# Altium project Dashcam_V2.0B.PrjPcb (part 5 of 7)

## Sheet CAMERA.SchDoc
size A2; DrawnBy: UKAYACIK; Engineer: UKAYACIK; Organization: UKAYACIK; DocumentNumber: 21; Revision: B; SheetNumber: 21; SheetTotal: 21
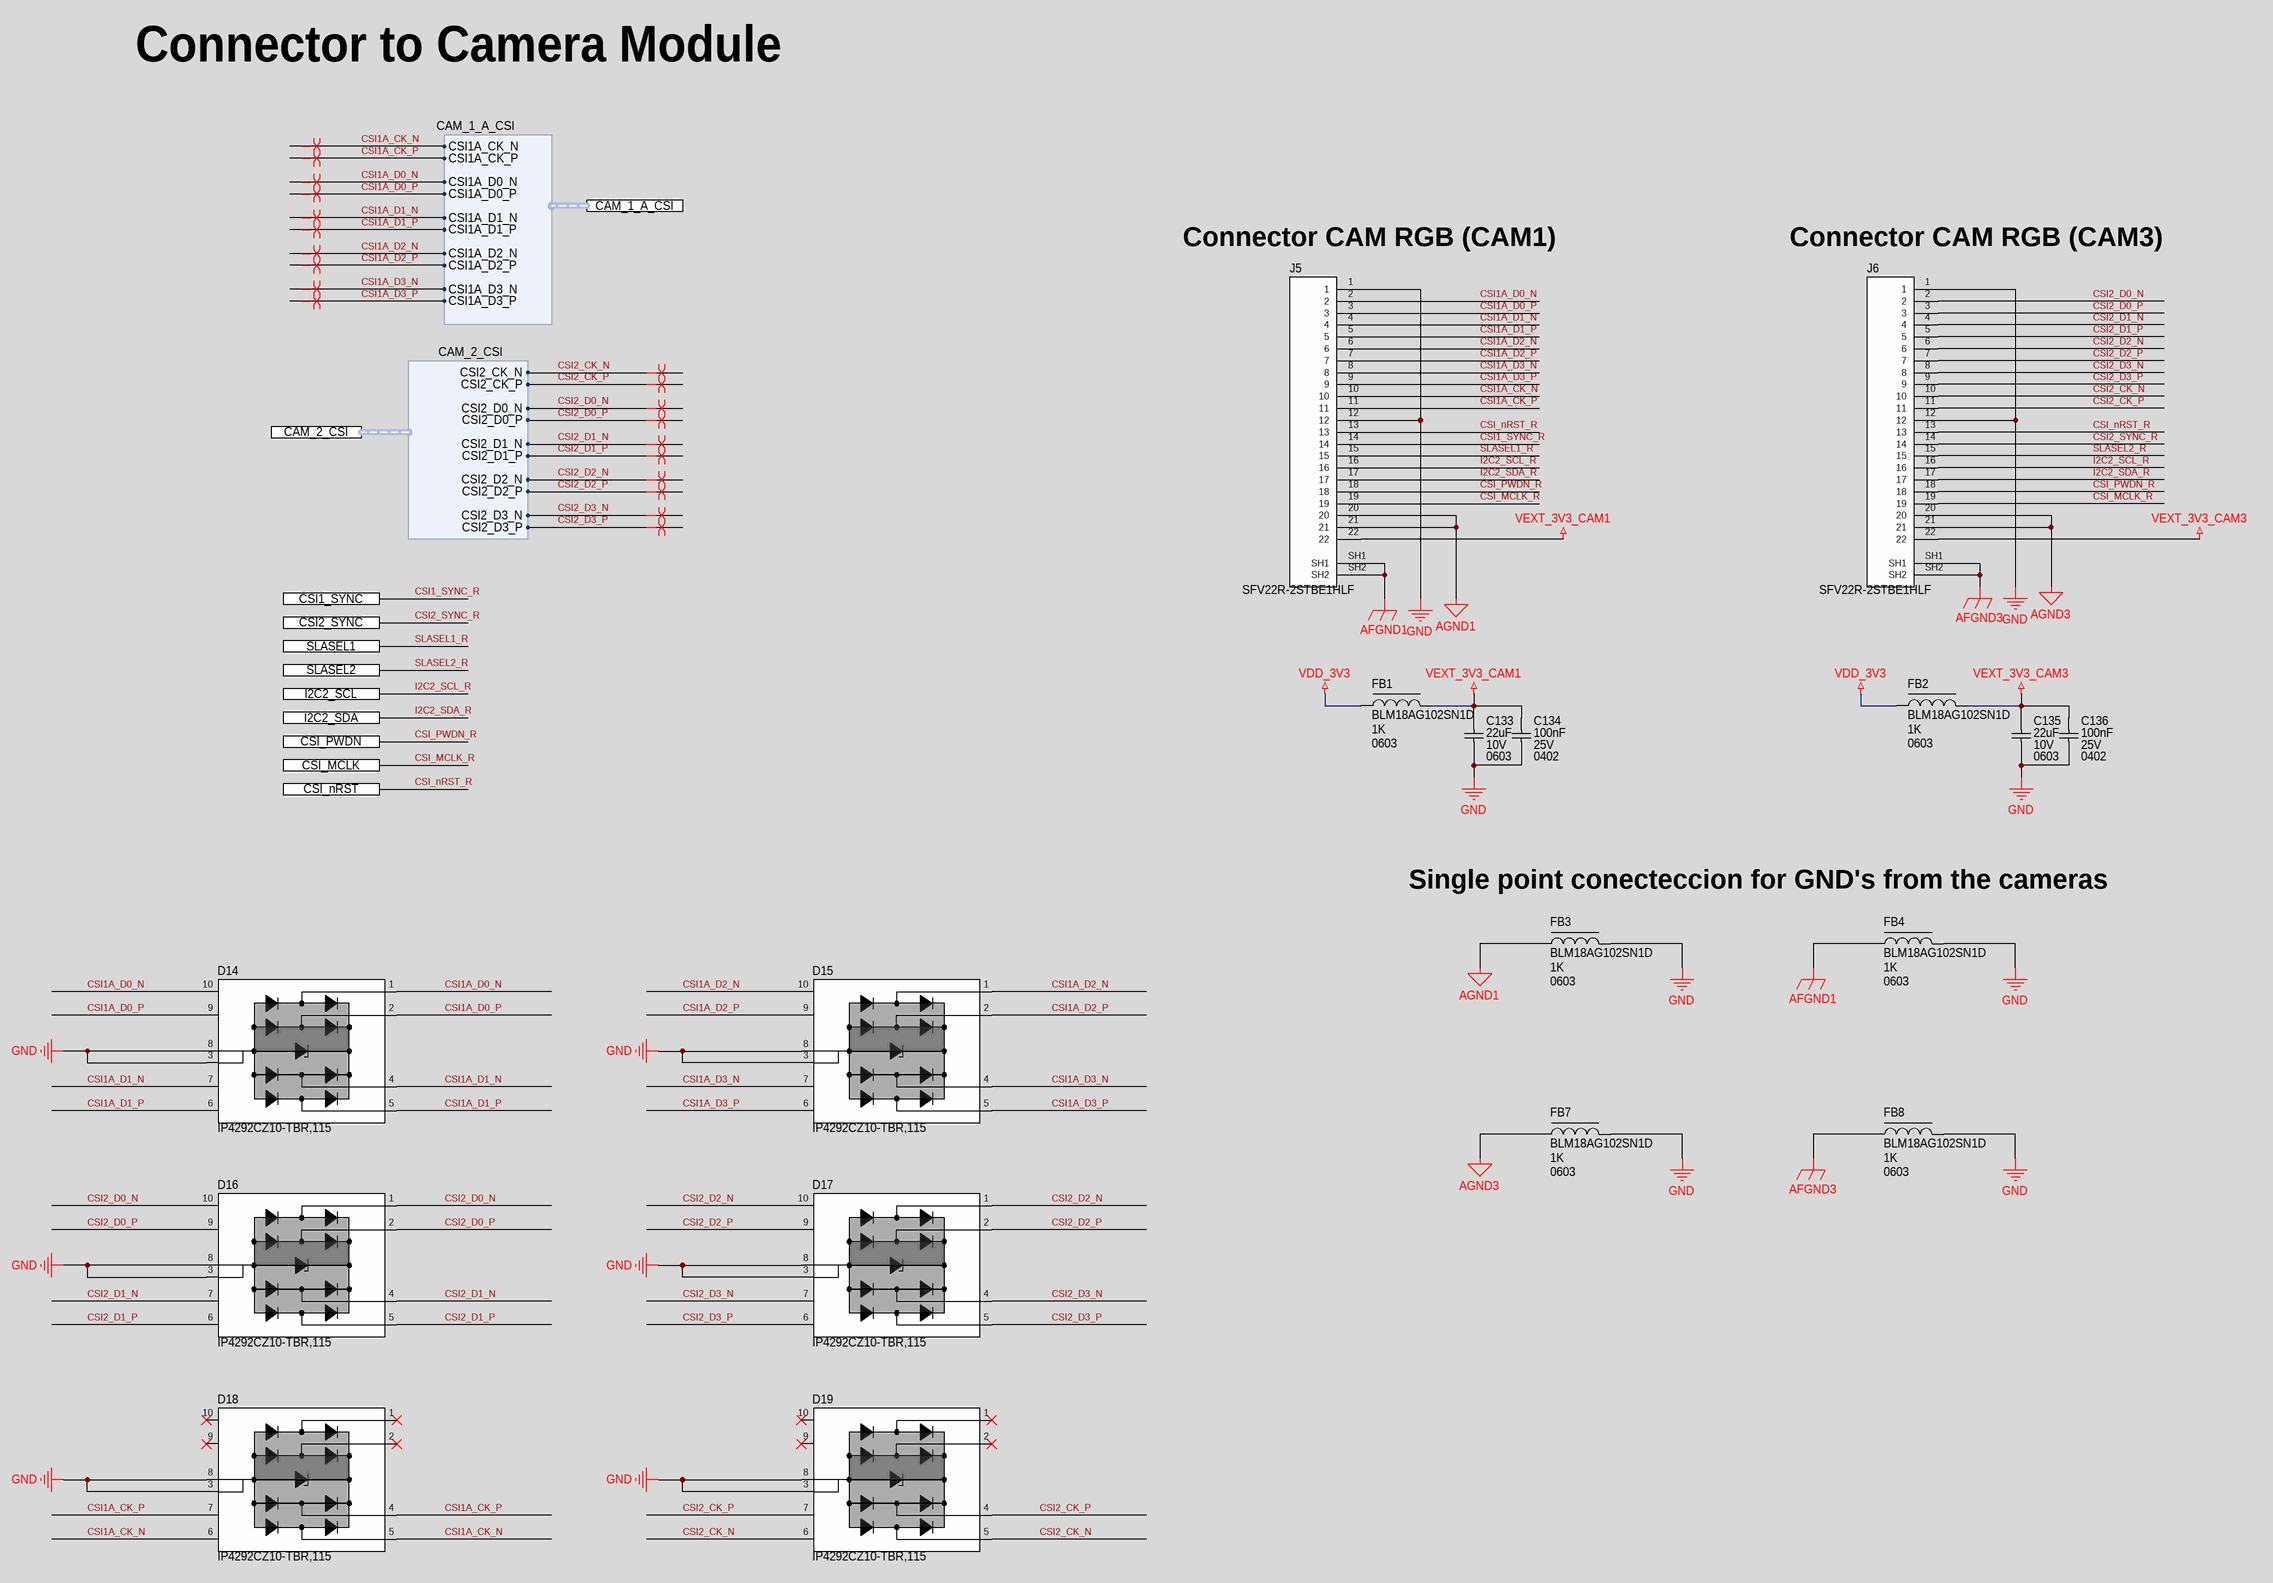
[diagram p11: CAMERA.SchDoc]

### Parts
C133  Capacitance: 22uF  Voltage Rating: 10V  Case Code (Imperial): 0603  [CAP_0603_CAPC1608X08N]  (hidden comment: C1608X5R1A226M080AC)
C134  Capacitance: 100nF  Voltage Rating: 25V  Case/Package: 0402  [CAP_0402_CAPC1005X05N]  (hidden comment: CC0402KRX5R8BB104)
C135  Capacitance: 22uF  Voltage Rating: 10V  Case Code (Imperial): 0603  [CAP_0603_CAPC1608X08N]  (hidden comment: C1608X5R1A226M080AC)
C136  Capacitance: 100nF  Voltage Rating: 25V  Case/Package: 0402  [CAP_0402_CAPC1005X05N]  (hidden comment: CC0402KRX5R8BB104)
D14  IP4292CZ10-TBR,115  [DIO_TVS_SON50P100X250X50-10N]
D15  IP4292CZ10-TBR,115  [DIO_TVS_SON50P100X250X50-10N]
D16  IP4292CZ10-TBR,115  [DIO_TVS_SON50P100X250X50-10N]
D17  IP4292CZ10-TBR,115  [DIO_TVS_SON50P100X250X50-10N]
D18  IP4292CZ10-TBR,115  [DIO_TVS_SON50P100X250X50-10N]
D19  IP4292CZ10-TBR,115  [DIO_TVS_SON50P100X250X50-10N]
FB1  BLM18AG102SN1D  Impedance: 1K  Case/Package: 0603  [IND_0603_INDC1608X08N]
FB2  BLM18AG102SN1D  Impedance: 1K  Case/Package: 0603  [IND_0603_INDC1608X08N]
FB3  BLM18AG102SN1D  Impedance: 1K  Case/Package: 0603  [IND_0603_INDC1608X08N]
FB4  BLM18AG102SN1D  Impedance: 1K  Case/Package: 0603  [IND_0603_INDC1608X08N]
FB7  BLM18AG102SN1D  Impedance: 1K  Case/Package: 0603  [IND_0603_INDC1608X08N]
FB8  BLM18AG102SN1D  Impedance: 1K  Case/Package: 0603  [IND_0603_INDC1608X08N]
J5  SFV22R-2STBE1HLF  [CONN_FPC_AMPHENOL_SFV22R-2STBE1HLF]
J6  SFV22R-2STBE1HLF  [CONN_FPC_AMPHENOL_SFV22R-2STBE1HLF]

### Ports
CAM_1_A_CSI (harness CAM_1_A_CSI), CAM_2_CSI (harness CAM_2_CSI), CSI1_SYNC, CSI2_SYNC, CSI_MCLK, CSI_nRST, CSI_PWDN, I2C2_SCL, I2C2_SDA, SLASEL1, SLASEL2

### Harnesses
CAM_2_CSI: CSI2_CK_N, CSI2_CK_P, CSI2_D0_N, CSI2_D0_P, CSI2_D1_N, CSI2_D1_P, CSI2_D2_N, CSI2_D2_P, CSI2_D3_N, CSI2_D3_P
CAM_1_A_CSI: CSI1A_CK_N, CSI1A_CK_P, CSI1A_D0_N, CSI1A_D0_P, CSI1A_D1_N, CSI1A_D1_P, CSI1A_D2_N, CSI1A_D2_P, CSI1A_D3_N, CSI1A_D3_P

### Nets
AFGND1: FB4.1 J5.SH1 J5.SH2
AFGND3: FB8.1 J6.SH1 J6.SH2
AGND1: FB3.1 J5.20 J5.21
AGND3: FB7.1 J6.20 J6.21
GND: C133.1 C134.1 C135.1 C136.1 D14.3(GND1) D14.8(GND2) D15.3(GND1) D15.8(GND2) D16.3(GND1) D16.8(GND2) D17.3(GND1) D17.8(GND2) D18.3(GND1) D18.8(GND2) D19.3(GND1) D19.8(GND2) FB3.2 FB4.2 FB7.2 FB8.2 J5.1 J5.12 J6.1 J6.12
VDD_3V3: FB1.1 FB2.1
VEXT_3V3_CAM1: C133.2 C134.2 FB1.2 J5.22
VEXT_3V3_CAM3: C135.2 C136.2 FB2.2 J6.22
CSI1_SYNC_R: J5.14 J6.14 ; port CSI1_SYNC, port CSI2_SYNC  [also labelled CSI2_SYNC_R]  [project net CLKOUT2]
CSI1A_CK_N: D18.5(CH4) D18.6(NC1) J5.10 ; port CAM_1_A_CSI.CSI1A_CK_N  [project net CSI1_CK_N]
CSI1A_CK_P: D18.4(CH3) D18.7(NC2) J5.11 ; port CAM_1_A_CSI.CSI1A_CK_P  [project net CSI1_CK_P]
CSI1A_D0_N: D14.1(CH1) D14.10(NC4) J5.2 ; port CAM_1_A_CSI.CSI1A_D0_N  [project net CSI1_D0_N]
CSI1A_D0_P: D14.2(CH2) D14.9(NC3) J5.3 ; port CAM_1_A_CSI.CSI1A_D0_P  [project net CSI1_D0_P]
CSI1A_D1_N: D14.4(CH3) D14.7(NC2) J5.4 ; port CAM_1_A_CSI.CSI1A_D1_N  [project net CSI1_D1_N]
CSI1A_D1_P: D14.5(CH4) D14.6(NC1) J5.5 ; port CAM_1_A_CSI.CSI1A_D1_P  [project net CSI1_D1_P]
CSI1A_D2_N: D15.1(CH1) D15.10(NC4) J5.6 ; port CAM_1_A_CSI.CSI1A_D2_N  [project net CSI1_D2_N]
CSI1A_D2_P: D15.2(CH2) D15.9(NC3) J5.7 ; port CAM_1_A_CSI.CSI1A_D2_P  [project net CSI1_D2_P]
CSI1A_D3_N: D15.4(CH3) D15.7(NC2) J5.8 ; port CAM_1_A_CSI.CSI1A_D3_N  [project net CSI1_D3_N]
CSI1A_D3_P: D15.5(CH4) D15.6(NC1) J5.9 ; port CAM_1_A_CSI.CSI1A_D3_P  [project net CSI1_D3_P]
CSI2_CK_N: D19.5(CH4) D19.6(NC1) J6.10 ; port CAM_2_CSI.CSI2_CK_N
CSI2_CK_P: D19.4(CH3) D19.7(NC2) J6.11 ; port CAM_2_CSI.CSI2_CK_P
CSI2_D0_N: D16.1(CH1) D16.10(NC4) J6.2 ; port CAM_2_CSI.CSI2_D0_N
CSI2_D0_P: D16.2(CH2) D16.9(NC3) J6.3 ; port CAM_2_CSI.CSI2_D0_P
CSI2_D1_N: D16.4(CH3) D16.7(NC2) J6.4 ; port CAM_2_CSI.CSI2_D1_N
CSI2_D1_P: D16.5(CH4) D16.6(NC1) J6.5 ; port CAM_2_CSI.CSI2_D1_P
CSI2_D2_N: D17.1(CH1) D17.10(NC4) J6.6 ; port CAM_2_CSI.CSI2_D2_N
CSI2_D2_P: D17.2(CH2) D17.9(NC3) J6.7 ; port CAM_2_CSI.CSI2_D2_P
CSI2_D3_N: D17.4(CH3) D17.7(NC2) J6.8 ; port CAM_2_CSI.CSI2_D3_N
CSI2_D3_P: D17.5(CH4) D17.6(NC1) J6.9 ; port CAM_2_CSI.CSI2_D3_P
CSI_MCLK_R: J5.19 J6.19 ; port CSI_MCLK
CSI_nRST_R: J5.13 J6.13 ; port CSI_nRST
CSI_PWDN_R: J5.18 J6.18 ; port CSI_PWDN
I2C2_SCL_R: J5.16 J6.16 ; port I2C2_SCL  [project net I2C2_SCL]
I2C2_SDA_R: J5.17 J6.17 ; port I2C2_SDA  [project net I2C2_SDA]
SLASEL1_R: J5.15 ; port SLASEL1
SLASEL2_R: J6.15 ; port SLASEL2

Not connected (* = marked no-connect by the designer): D18 1(CH1)* 2(CH2)* 9(NC3)* 10(NC4)*; D19 1(CH1)* 2(CH2)* 9(NC3)* 10(NC4)*

### Layout directives
differential pair; differential pair class Z100: CSI1_CK_N, CSI1_CK_P, CSI1_D0_N, CSI1_D0_P, CSI1_D1_N, CSI1_D1_P, CSI1_D2_N, CSI1_D2_P, CSI1_D3_N, CSI1_D3_P, CSI2_CK_N, CSI2_CK_P, CSI2_D0_N, CSI2_D0_P, CSI2_D1_N, CSI2_D1_P, CSI2_D2_N, CSI2_D2_P, CSI2_D3_N, CSI2_D3_P

### Notes on the sheet
- Connector to Camera Module
- (near J5) Connector CAM RGB (CAM1)
- (near J6) Connector CAM RGB (CAM3)
- Single point conecteccion for GND's from the cameras
- PCB Des :
- Approv By :
- Project Title :
- Sheet Title :
- Date :
- Page :
- PCB Version :
- PCB Revision :
- Size :
- A2

### Library data of the parts
C133 C135 = CAP_22UF_10V_X5R_0603: Multilayer Ceramic Capacitor, 22 uF, 10 V, ± 20%, X5R, 0603 [1608 Metric]; Manufacturer: TDK; Supplier 1: Digi-Key; Manufacturer Part Number: C1608X5R1A226M080AC; RoHS: Yes; Category: Ceramic Capacitors; Stock 1: 1971709; Pricing 1: 1=0.32, 10=0.208, 50=0.1534, 100=0.1248, 500=0.09856, 1000=0.08323 (USD); Mount: Surface Mount; Case/Package: 0603; Case Code (Metric): 1608; Dielectric Material: Ceramic; Weight: 7.1E-05oz; Min Operating Temperature: -55°C; Max Operating Temperature: 85°C; Tolerance: 20%; Packaging: Tape and Reel; Voltage Rating (DC): 10V; Termination: SMD/SMT; Series: C; Package Quantity: 4000; Dielectric: X5R; Length: 1.6mm; Width: 0.8mm; Height: 0.8mm; Reach SVHC Compliant: No; Lead Free: Lead Free; RoHS Compliant: Yes; ComponentLink1URL: https://datasheet.ciiva.com/6274/tdkmlcccaprange-6274860.pdf?src-supplier=Digi-Key; ComponentLink1Description: https://datasheet.ciiva.com/6274/tdkmlcccaprange-6274860.pdf?src-supplier=Digi-Key; ComponentLink2URL: https://datasheet.ciiva.com/6274/tdkmlcccaprange-6274859.pdf?src-supplier=Digi-Key; ComponentLink2Description: https://datasheet.ciiva.com/6274/tdkmlcccaprange-6274859.pdf?src-supplier=Digi-Key; ComponentLink3URL: https://datasheet.ciiva.com/6274/tdkmlcccaprange-6274861.pdf?src-supplier=Digi-Key; ComponentLink3Description: https://datasheet.ciiva.com/6274/tdkmlcccaprange-6274861.pdf?src-supplier=Digi-Key; ComponentLink4URL: https://datasheet.ciiva.com/24216/mlcc-commercial-general-en-24216575.pdf?src-supplier=Mouser; ComponentLink4Description: https://datasheet.ciiva.com/24216/mlcc-commercial-general-en-24216575.pdf?src-supplier=Mouser; Supplier Part Number 1: 445-9077-1-ND
C134 C136 = CAP_100NF_25V_X7R_0402: Multilayer Ceramic Capacitor, 0.1 uF, 25 V, ± 10%, X7R, 0402 [1005 Metric]; Manufacturer: Yageo; Material: 4241ConductorMaterial; Dielectric: X5R; Temperature Coefficient: 30ppm/°C; Supplier 1: Digikey; Manufacturer Part Number: CC0402KRX5R8BB104; RoHS: Yes; Category: Ceramic Capacitors; Stock 1: 3706055; Pricing 1: 1=0.1, 10=0.037, 50=0.021, 100=0.0162, 500=0.01224, 1000=0.00961, 2500=0.00874, 5000=0.00804 (USD); Mount: Surface Mount; Case Code (Metric): 1005; Case Code (Imperial): 0402; Min Operating Temperature: -55°C; Max Operating Temperature: 85°C; Tolerance: 10%; Packaging: Tape and Reel; Voltage Rating (DC): 25V; Series: CC; RoHS Compliant: Yes; Lead Free: 5697LeadFree; Halogen Free: 5694HalogenFree; ComponentLink1URL: http://www.mouser.com/ds/2/447/UPY-GPHC_X5R_4V-to-50V_25-1131599.pdf?src-supplier=Mouser; ComponentLink1Description: http://www.mouser.com/ds/2/447/UPY-GPHC_X5R_4V-to-50V_25-1131599.pdf?src-supplier=Mouser; ComponentLink2URL: https://datasheet.octopart.com/CC0402KRX5R8BB104-Yageo-datasheet-137700082.pdf?src-supplier=Future+Electronics; ComponentLink2Description: https://datasheet.octopart.com/CC0402KRX5R8BB104-Yageo-datasheet-137700082.pdf?src-supplier=Future+Electronics; ComponentLink3URL: http://www.yageo.com/documents/recent/UPY-GPHC_X5R_4V-to-50V_25.pdf?src-supplier=Digikey; ComponentLink3Description: http://www.yageo.com/documents/recent/UPY-GPHC_X5R_4V-to-50V_25.pdf?src-supplier=Digikey; ComponentLink4URL: https://datasheet.octopart.com/CC0402KRX5R8BB104-Yageo-datasheet-140260304.pdf?src-supplier=Newark; ComponentLink4Description: https://datasheet.octopart.com/CC0402KRX5R8BB104-Yageo-datasheet-140260304.pdf?src-supplier=Newark; ComponentLink5URL: https://datasheet.octopart.com/CC0402KRX5R8BB104-Yageo-datasheet-170350636.pdf?src-supplier=Future+Electronics; ComponentLink5Description: https://datasheet.octopart.com/CC0402KRX5R8BB104-Yageo-datasheet-170350636.pdf?src-supplier=Future+Electronics; ComponentLink6URL: http://www.yageo.com/documents/recent/UPY-GPHC_X5R_4V-to-50V-16.pdf?src-supplier=Future+Electronics; ComponentLink6Description: http://www.yageo.com/documents/recent/UPY-GPHC_X5R_4V-to-50V-16.pdf?src-supplier=Future+Electronics; Supplier Part Number 1: 311-1697-6-ND
D14-D19 = DIO_TVS_4CH_4V_IP4292CZ10-TBR,115: IP4292CZ10 Series 4 Channel 4 V 0.55 pF ESD Protected TVS Diode - DFN2510A-10; Manufacturer: Nexperia; Supplier 1: Digikey; Manufacturer Part Number: IP4292CZ10-TBR,115; RoHS: Yes; Category: ESD and Circuit Protection ICs; Stock 1: 24808; Pricing 1: 1=0.51, 10=0.398, 100=0.2386, 500=0.22096, 1000=0.15025, 2000=0.13833 (USD); RoHS Compliant: Yes; ComponentLink1URL: https://assets.nexperia.com/documents/data-sheet/IP4292CZ10-TBR.pdf?src-supplier=Digikey; ComponentLink1Description: https://assets.nexperia.com/documents/data-sheet/IP4292CZ10-TBR.pdf?src-supplier=Digikey; Supplier Part Number 1: 1727-1219-1-ND
FB1-FB4 FB7 FB8 = IND_FERRITA_1K_450mA_BLM18AG102SN1D: Ferrite Beads Multi-Layer 1KOhm 25% 100MHz 450mA 500mOhm DCR 0603 T/R; Manufacturer: Murata; Material: Steel,Ferrite; Max DC Current: 400mA; DC Resistance (DCR): 500mR; Number of Lines: 1; Shielding: Unshielded; DC Resistance-Max: 700mR; Supplier 1: Digikey; Manufacturer Part Number: BLM18AG102SN1D; RoHS: Yes; Category: Ferrite Beads and Chips; Stock 1: 632067; Pricing 1: 1=0.1, 10=0.074, 25=0.0676, 50=0.0608, 100=0.0445, 250=0.0324, 500=0.02968, 1000=0.02564 (USD); Number of Pins: 2; Core Material: Ferrite; Case Code (Metric): 1608; Case Code (Imperial): 0603; Min Operating Temperature: -55°C; Max Operating Temperature: 125°C; Tolerance: 25%; Package Quantity: 1; Resistance: 500mR; Packaging: Tape and Reel; Current Rating: 400mA; Max Current Rating: 400mA; Termination: SMD/SMT; Test Frequency: 100MHz; DC Current: 400mA; Frequency: 100MHz; Number of Circuits: 1; Series: BLM18A; RMS Current (Irms): 450mA; Series Resistance: 500mR; Length: 1.6mm; Width: 0.8mm; Height: 0.8mm; Depth: 0.8mm; Radiation Hardening: No; Reach SVHC Compliant: No; Military Standard: Not; Lead Free: Lead Free; RoHS Compliant: Yes; ComponentLink1URL: https://datasheet.ciiva.com/1012/l0110s0100blm18a-1012016.pdf?src-supplier=Digikey; ComponentLink1Description: https://datasheet.ciiva.com/1012/l0110s0100blm18a-1012016.pdf?src-supplier=Digikey; ComponentLink2URL: https://datasheet.ciiva.com/5709/1756147-5709056.pdf?src-supplier=Farnell; ComponentLink2Description: https://datasheet.ciiva.com/5709/1756147-5709056.pdf?src-supplier=Farnell; ComponentLink3URL: https://datasheet.ciiva.com/11795/0900766b80032ea2-11795437.pdf?src-supplier=Rs; ComponentLink3Description: https://datasheet.ciiva.com/11795/0900766b80032ea2-11795437.pdf?src-supplier=Rs; ComponentLink4URL: https://datasheet.ciiva.com/29347/442253-da-01-en-chip-drossel-0603-1000r-400ma-1-6x0-8mm-29347887.pdf?src-supplier=Conrad; ComponentLink4Description: https://datasheet.ciiva.com/29347/442253-da-01-en-chip-drossel-0603-1000r-400ma-1-6x0-8mm-29347887.pdf?src-supplier=Conrad; ComponentLink5URL: https://datasheet.ciiva.com/41449/001172220-da-01-en-drossel-0603-1000r-1-6x0-8mm-4000st-41449508.pdf?src-supplier=Conrad; ComponentLink5Description: https://datasheet.ciiva.com/41449/001172220-da-01-en-drossel-0603-1000r-1-6x0-8mm-4000st-41449508.pdf?src-supplier=Conrad; ComponentLink6URL: https://datasheet.ciiva.com/1012/l0110s0100blm18a-1012014.pdf?src-supplier=Digikey; ComponentLink6Description: https://datasheet.ciiva.com/1012/l0110s0100blm18a-1012014.pdf?src-supplier=Digikey; ComponentLink7URL: https://datasheet.ciiva.com/1012/l0110s0100blm18a-1012015.pdf?src-supplier=Digikey; ComponentLink7Description: https://datasheet.ciiva.com/1012/l0110s0100blm18a-1012015.pdf?src-supplier=Digikey; ComponentLink8URL: https://datasheet.ciiva.com/16199/l0110s0100blm18a-16199225.pdf?src-supplier=Future+Electronics; ComponentLink8Description: https://datasheet.ciiva.com/16199/l0110s0100blm18a-16199225.pdf?src-supplier=Future+Electronics; ComponentLink9URL: https://datasheet.ciiva.com/8510/l0110s0100blm18a-8510154.pdf?src-supplier=Avnet; ComponentLink9Description: https://datasheet.ciiva.com/8510/l0110s0100blm18a-8510154.pdf?src-supplier=Avnet; ComponentLink10URL: https://datasheet.ciiva.com/1466/1756147-1466919.pdf?src-supplier=Element14; ComponentLink10Description: https://datasheet.ciiva.com/1466/1756147-1466919.pdf?src-supplier=Element14; ComponentLink11URL: https://datasheet.ciiva.com/1466/1756147-1466920.pdf?src-supplier=Element14; ComponentLink11Description: https://datasheet.ciiva.com/1466/1756147-1466920.pdf?src-supplier=Element14; Supplier Part Number 1: 490-1015-1-ND
J5 J6 = CONN_FPC_22P_0.5mm_SFV22R-2STBE1HLF: Conn FFC/FPC Connector SKT 22 POS 0.5mm Solder RA SMD Embossed T/R; Manufacturer: Amphenol ICC / FCI; Actuator Material: Glass,Polyphenylene; Voltage Rating: 50V; Current Rating: 500mA; Number of Positions: 22; Contact Location: Top; Insulation Resistance: 100MR; Wire/Cable Type: Straight; Supplier 1: Digikey; Manufacturer Part Number: SFV22R-2STBE1HLF; RoHS: Yes; Category: FFC / FPC; Stock 1: 4153; Pricing 1: 1=0.74, 10=0.627, 25=0.6016, 50=0.5888, 100=0.5633, 250=0.51208, 500=0.46086, 1000=0.40966 (USD); Mount: Surface Mount; Contact Material: Bronze; Contact Plating: Gold; Housing Material: Polymer; Min Operating Temperature: -55°C; Max Operating Temperature: 105°C; Termination: Solder; Number of Contacts: 22; Orientation: Right Angle; Packaging: Tape and Reel; Package Quantity: 3000; Series: SFV-R; Pitch: 0.5mm; Radiation Hardening: No; Flammability Rating: UL94 V-0; RoHS Compliant: Yes; ComponentLink1URL: https://datasheet.ciiva.com/18563/sfv12b-hlf-18563830.pdf?src-supplier=Digikey; ComponentLink1Description: https://datasheet.ciiva.com/18563/sfv12b-hlf-18563830.pdf?src-supplier=Digikey; Supplier Part Number 1: 609-SFV22R-2STBE1HLFCT-ND

## Sheet PMIC.SchDoc: PMIC - BLOCK DIAGRAM
size A3; DrawnBy: UKAYACIK; Engineer: UKAYACIK; DocumentNumber: 9; Revision: B; SheetNumber: 9; SheetTotal: 21
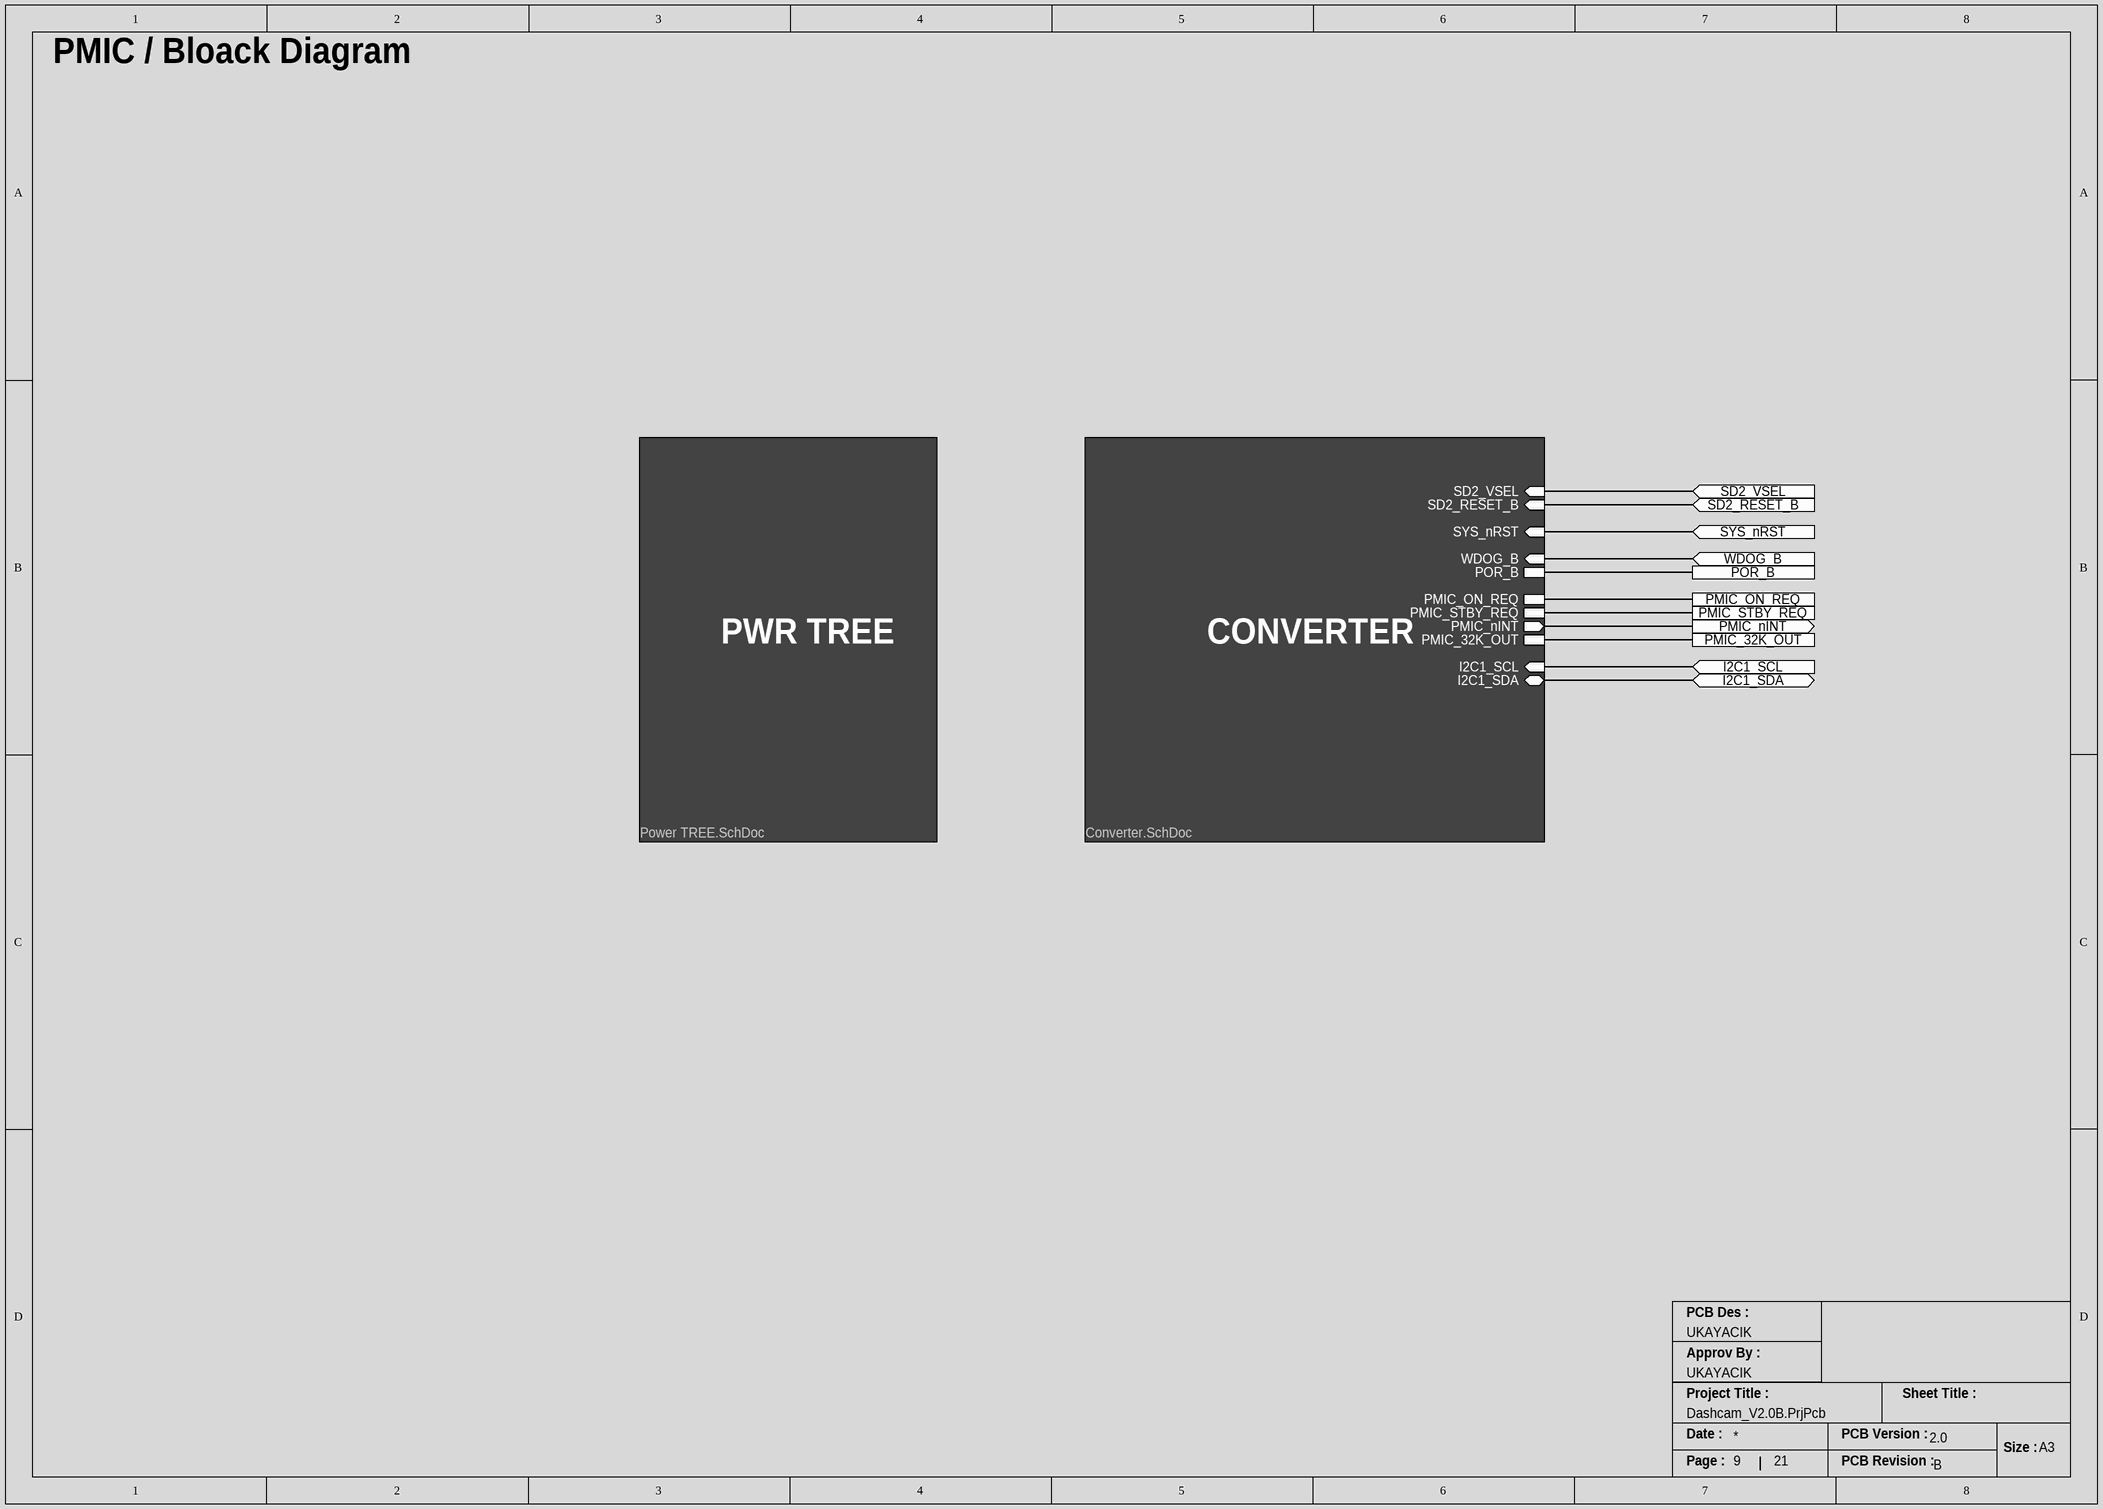
[diagram p12: PMIC.SchDoc]

### Sub-sheets
O = Power TREE.SchDoc (file not in this document): no entries
P = Converter.SchDoc: SD2_VSEL (in), PMIC_ON_REQ, PMIC_STBY_REQ, WDOG_B (in), SYS_nRST (in), POR_B, PMIC_nINT (out), PMIC_32K_OUT, SD2_RESET_B (in), I2C1_SCL (in), I2C1_SDA (bidir)

### Ports
I2C1_SCL (in), I2C1_SDA (bidir), PMIC_32K_OUT, PMIC_nINT (out), PMIC_ON_REQ, PMIC_STBY_REQ, POR_B, SD2_RESET_B (in), SD2_VSEL (in), SYS_nRST (in), WDOG_B (in)

### Nets
I2C1_SCL: port I2C1_SCL, sheet P/I2C1_SCL
I2C1_SDA: port I2C1_SDA, sheet P/I2C1_SDA
PMIC_nINT: port PMIC_nINT, sheet P/PMIC_nINT
PMIC_ON_REQ: port PMIC_ON_REQ, sheet P/PMIC_ON_REQ
PMIC_STBY_REQ: port PMIC_STBY_REQ, sheet P/PMIC_STBY_REQ
POR_B: port POR_B, sheet P/POR_B
SD2_RESET_B: port SD2_RESET_B, sheet P/SD2_RESET_B
SD2_VSEL: port SD2_VSEL, sheet P/SD2_VSEL
SLP_CLK_IN: port PMIC_32K_OUT, sheet P/PMIC_32K_OUT
SYS_nRST: port SYS_nRST, sheet P/SYS_nRST
WDOG_B: port WDOG_B, sheet P/WDOG_B

### Notes on the sheet
- PMIC / Bloack Diagram
- PWR TREE
- CONVERTER
- PCB Des :
- Approv By :
- Project Title :
- Sheet Title :
- Date :
- PCB Version :
- Size :
- A3
- Page :
- PCB Revision :